# EAGLE design kiosk_power_revB (EAGLE 9.0.0)
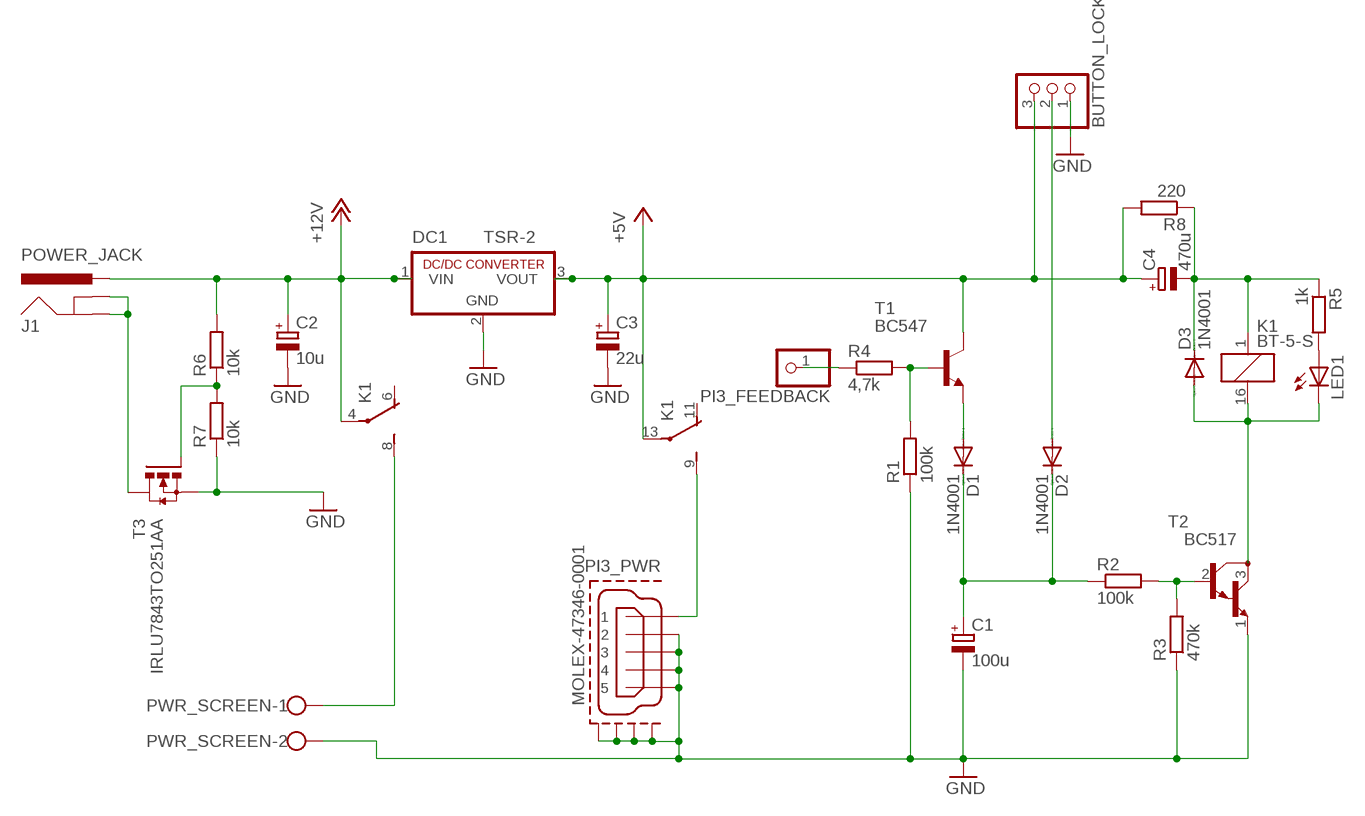
[diagram p0: schematic, sheet 1]

## Parts
BUTTON_LOCK  PINHD-1X3/90  [1X03/90]
C1  100u  CPOL-EUE2.5-5  [E2,5-5]
C2  10u  CPOL-EUE2.5-6  [E2,5-6]
C3  22u  CPOL-EUE2.5-5  [E2,5-5]
C4  470u  CPOL-EUE2-5  [E2-5]
D1  1N4001  [DO41-10]
D2  1N4001  [DO41-10]
D3  1N4001  [DO41-10]
DC1  TSR-2  [SIP3]
J1  POWER_JACK  [POWER_JACK_PTH]
K1  BT-5-S  [BT-XX-S]
LED1  LED3MM  [LED3MM]
PI3_FEEDBACK  PINHD-1X1/90  [1X01/90]
PI3_PWR  MOLEX-47346-0001  [MOLEX-47364-0001]
PWR_SCREEN  W237-102  [W237-102]
R1  100k  R-EU_0207/7  [0207/7]
R2  100k  R-EU_0207/7  [0207/7]
R3  470k  R-EU_0207/7  [0207/7]
R4  4,7k  R-EU_0207/7  [0207/7]
R5  1k  R-EU_0207/7  [0207/7]
R6  10k  R-EU_0207/7  [0207/7]
R7  10k  R-EU_0207/7  [0207/7]
R8  220  R-EU_0207/7  [0207/7]
T1  BC547  [TO92]
T2  BC517  [TO92]
T3  IRLU7843TO251AA  [TO251AA-V]

## Nets
+5V: BUTTON_LOCK.3 C3.+ C4.+ DC1.3(VOUT) K1.13(-2:P) R8.2 T1.3(C)
+12V: C2.+ DC1.1(VIN) J1.PWR K1.4(-1:P) R6.2
GND: BUTTON_LOCK.1 C1.- C2.- C3.- DC1.2(GND) PI3_PWR.2 PI3_PWR.3 PI3_PWR.4 PI3_PWR.5 PI3_PWR.GND1 PI3_PWR.GND2 PI3_PWR.GND3 PI3_PWR.GND4 PWR_SCREEN.2 R1.1 R3.1 R7.1 T2.1(E) T3.3(S)
N$1: J1.GND J1.GNDBREAK T3.2(D)
N$2: K1.8(-1:S) PWR_SCREEN.1
N$3: C4.- D3.C K1.1 R5.1 R8.1
N$4: PI3_FEEDBACK.1 R4.1
N$5: K1.9(-2:S) PI3_PWR.1
N$6: D3.A K1.16 LED1.K(C) T2.3(C)
N$7: BUTTON_LOCK.2 D2.A
N$8: R6.1 R7.2 T3.1(G)
N$9: R1.2 R4.2 T1.2(B)
N$10: D1.A T1.1(E)
N$11: C1.+ D1.C D2.C R2.1
N$12: LED1.A R5.2
N$13: R2.2 R3.2 T2.2(B)
Unconnected: K1.6(-1:O) K1.11(-2:O)

## Library data of the parts
BUTTON_LOCK = pinhead:PINHD-1X3: PIN HEADER
C1-C4 = resistor:CPOL-EU: POLARIZED CAPACITOR, European symbol
D1-D3 = kiosk:1N4001: DIODE general purpose rectifier, 1 A
DC1 = kiosk:TSR-2: TSR 2 Description: The new TSR 2 series step-down switching regulators are drop-in replacement for inefficient LMxx linear regulators. A high efficiency up to 96 % allows full load operation up to +67°C ambient temperature without the need of any heat-sink or forced cooling. The TSR 2 switching regulators provide other significant features over linear regulators, i.e. better output accuracy (±2 %), lower standby current of 2 mA and no requirement of external capacitors. The high efficiency and low standby power consumption makes these regulators an ideal solution for many battery powered applications. Datasheet: TSR 2 <http://assets.tracopower.com/20180412091955/TSR2/documents/tsr2-datasheet.pdf>; MF: Traco; OC_NEWARK: 85Y2519
J1 = kiosk:POWER_JACK: Power Jack Connector This is the standard 5.5mm barrel jack for power. The PTH is the most common, proven, reliable, footprint. The Slot footprint only works if the mill layer is transmitted to the PCB fab house so be warned. Here are the connectors we sell at SparkFun: DC Barrel Power Jack/Connector <https://www.sparkfun.com/products/119> (PRT-00119) DC Barrel Power Jack/Connector (SMD) <https://www.sparkfun.com/products/12748> (PRT-12748) DC Barrel Jack Adapter - Breadboard Compatible <https://www.sparkfun.com/products/10811> (PRT-10811) It is used on this SparkFun product (and many, many others): SparkFun RedBoard - Programmed with Arduino <https://www.sparkfun.com/products/12757> (DEV-12757) Also, if you need a mating power supply or connector, please check these out: Wall Adapter Power Supply - 9VDC 650mA <https://www.sparkfun.com/products/298> (TOL-00298) DC Barrel Jack Adapter - Male <https://www.sparkfun.com/products/10287> (PRT-10287); PROD_ID: CONN-08197
K1 = relay:BT-*-S: KLEIN RELAIS WASCHDICHT 2 Wechsler Distriibutor: Conrad Electronic, Bestell Nr.: 505226-13 - 24V 505226-13 - 5V 505170-13 - 12V 505170-13 - 48V Bestar Electric Ltd. Source: http://www2.produktinfo.conrad.com/datenblaetter/500000-524999/505226-da-01-en-Kleinrelais_waschdicht_24V.pdf; OC_FARNELL: unknown; OC_NEWARK: unknown
LED1 = led:LED: LED OSRAM: - CHIPLED LG R971, LG N971, LY N971, LG Q971, LY Q971, LO R971, LY R971 LH N974, LH R974 LS Q976, LO Q976, LY Q976 LO Q996 - Hyper CHIPLED LW Q18S LB Q993, LB Q99A, LB R99A - SideLED LS A670, LO A670, LY A670, LG A670, LP A670 LB A673, LV A673, LT A673, LW A673 LH A674 LY A675 LS A676, LA A676, LO A676, LY A676, LW A676 LS A679, LY A679, LG A679 - Hyper Micro SIDELED® LS Y876, LA Y876, LO Y876, LY Y876 LT Y87S - SmartLED LW L88C, LW L88S LB L89C, LB L89S, LG L890 LS L89K, LO L89K, LY L89K LS L896, LA L896, LO L896, LY L896 - TOPLED LS T670, LO T670, LY T670, LG T670, LP T670 LSG T670, LSP T670, LSY T670, LOP T670, LYG T670 LG T671, LOG T671, LSG T671 LB T673, LV T673, LT T673, LW T673 LH T674 LS T676, LA T676, LO T676, LY T676, LB T676, LH T676, LSB T676, LW T676 LB T67C, LV T67C, LT T67C, LS T67K, LO T67K, LY T67K, LW E67C LS E67B, LA E67B, LO E67B, LY E67B, LB E67C, LV E67C, LT E67C LW T67C LS T679, LY T679, LG T679 LS T770, LO T770, LY T770, LG T770, LP T770 LB T773, LV T773, LT T773, LW T773 LH T774 LS E675, LA E675, LY E675, LS T675 LS T776, LA T776, LO T776, LY T776, LB T776 LHGB T686 LT T68C, LB T68C - Hyper Mini TOPLED® LB M676 - Mini TOPLED Santana® LG M470 LS M47K, LO M47K, LY M47K Source: http://www.osram.convergy.de LUXEON: - LUMILED® LXK2-PW12-R00, LXK2-PW12-S00, LXK2-PW14-U00, LXK2-PW14-V00 LXK2-PM12-R00, LXK2-PM12-S00, LXK2-PM14-U00 LXK2-PE12-Q00, LXK2-PE12-R00, LXK2-PE12-S00, LXK2-PE14-T00, LXK2-PE14-U00 LXK2-PB12-K00, LXK2-PB12-L00, LXK2-PB12-M00, LXK2-PB14-N00, LXK2-PB14-P00, LXK2-PB14-Q00 LXK2-PR12-L00, LXK2-PR12-M00, LXK2-PR14-Q00, LXK2-PR14-R00 LXK2-PD12-Q00, LXK2-PD12-R00, LXK2-PD12-S00 LXK2-PH12-R00, LXK2-PH12-S00 LXK2-PL12-P00, LXK2-PL12-Q00, LXK2-PL12-R00 Source: www.luxeon.com KINGBRIGHT: KA-3528ASYC Source: www.kingbright.com
PI3_FEEDBACK = kiosk:PINHD-1X1: PIN HEADER
PI3_PWR = kiosk:MOLEX-47346-0001: MICRO USB B, BOTTOM MOUNT
PWR_SCREEN = con-wago-500:W237-102: WAGO SCREW CLAMP; MPN: 237-102; OC_FARNELL: unknown; OC_NEWARK: 70K9898
R1-R8 = resistor:R-EU_: RESISTOR, European symbol
T1 = transistor:BC547: NPN TRANSISTOR
T2 = transistor:BC517: NPN BIPOLAR DARLINGTON TRANSISTOR
T3 = kiosk:IRLU7843: Power MOSFET; MF: International Rectifier

## Board
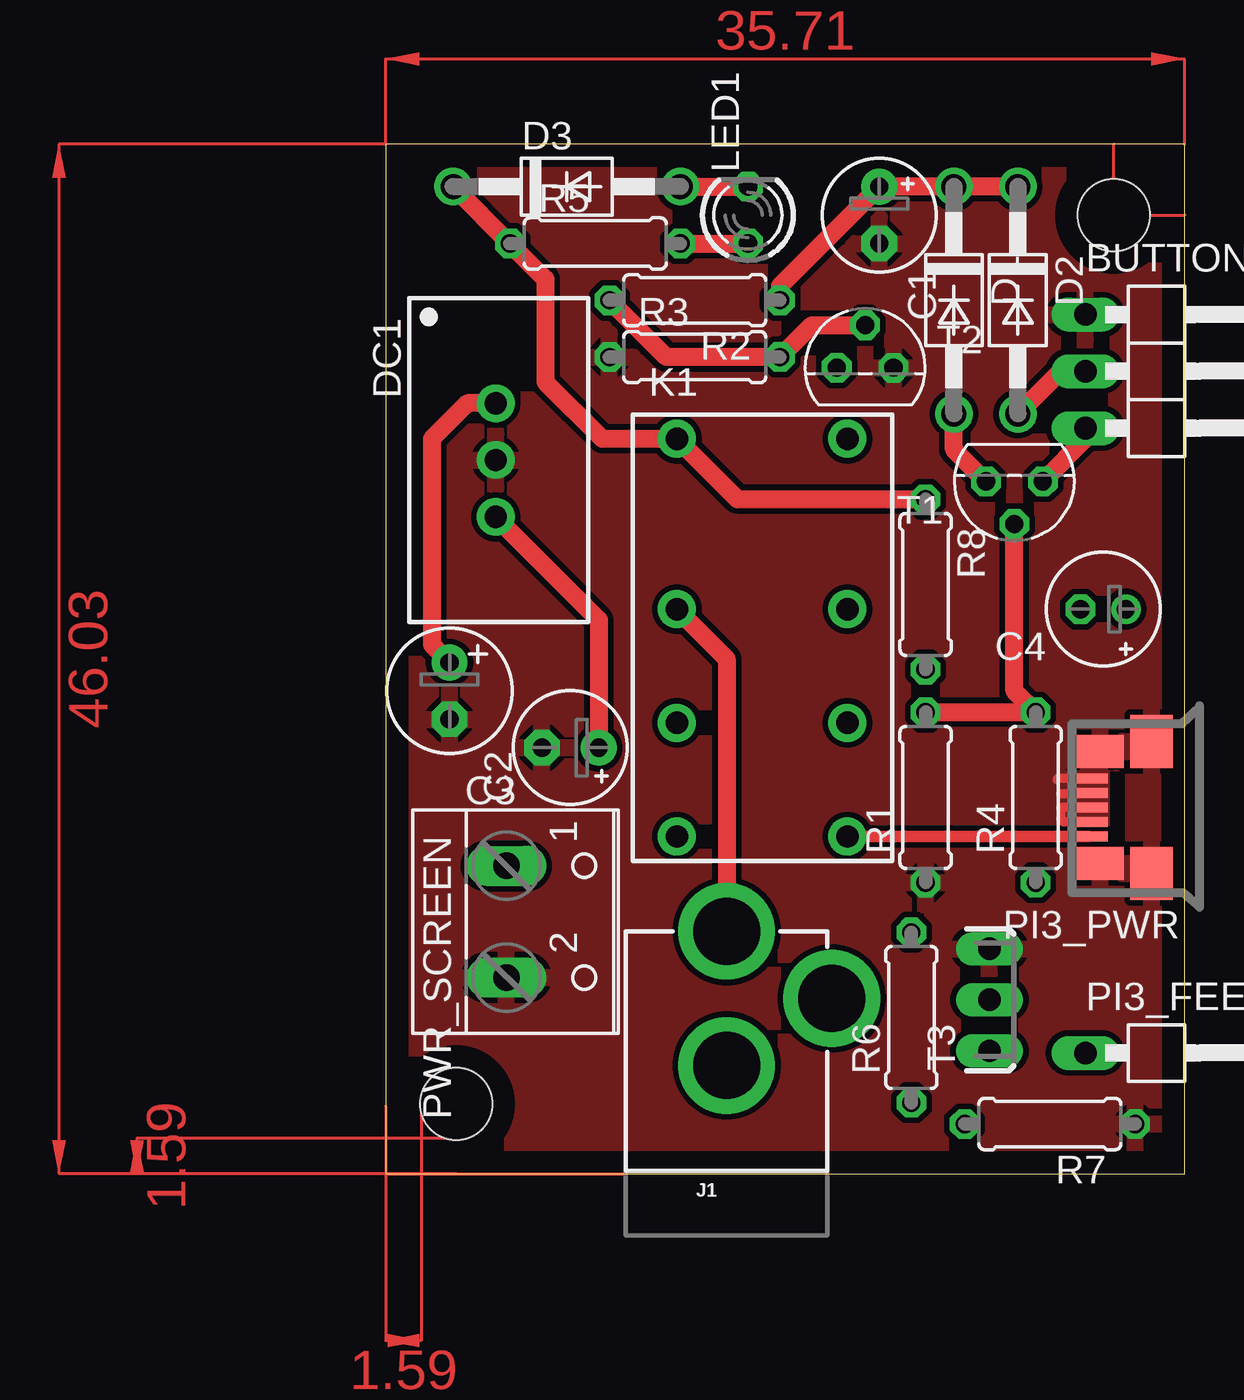
[diagram p1: board, top side]
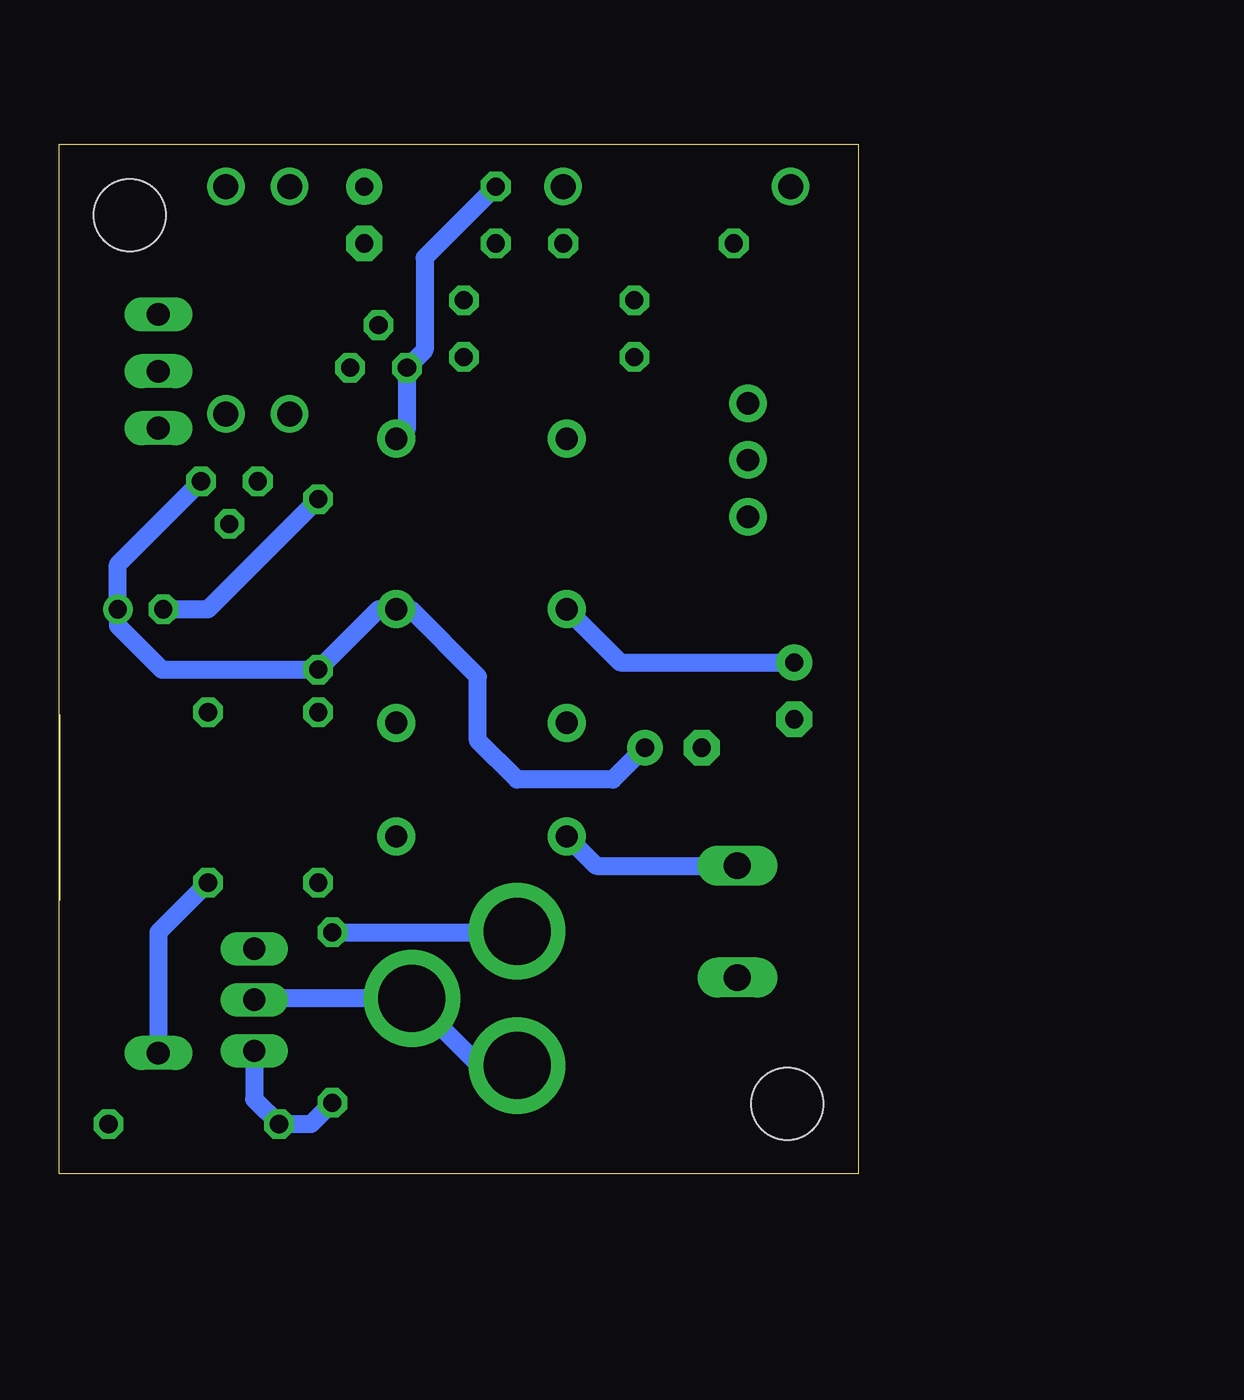
[diagram p2: board, bottom side, seen from below]

Size 35.71 x 46.03 mm. Coordinates in mm from the lower left corner, seen from the top.
Outline: 0,0 35.71,0 35.71,46.03 0,46.03 0,0
Copper layers (1*16): Top 0.035mm / dielectric 1.5mm / Bottom 0.035mm
Design rules "default *": minimum track width 6mil, minimum drill 0.35mm, track to track 10mil, track to pad 10mil, pad to pad 6mil, via to via 6mil, smd to smd 6mil, copper to edge 40mil, drill to drill 6mil, minimum pad ring 10mil, minimum via ring 8mil, stop-mask expansion 4mil, vias tented up to drill 0mil, thermal gap 10mil
Holes 3.2 mm at 3.16,3.13 32.54,42.86

### Footprints (pad centres in the part's own frame; a part is rotated, then mirrored left to right if it is on the bottom)
1X03/90 = drill 1.016 long: 1 -2.54,-3.81; 2 0,-3.81; 3 2.54,-3.81
E2,5-5 = drill 0.813 pad 1.6: + -1.27,0 | drill 0.813 pad 1.6 octagon: - 1.27,0
E2,5-6 = drill 0.813 pad 1.6: + -1.27,0 | drill 0.813 pad 1.6 octagon: - 1.27,0
E2-5 = drill 0.813 pad 1.27: + -1.016,0 | drill 0.813 pad 1.27 octagon: - 1.016,0
DO41-10 = drill 1.118: A 5.08,0; C -5.08,0
SIP3 = drill 1 pad 1.676: 1 -2.54,0; 2 0,0; 3 2.54,0
POWER_JACK_PTH = drill 2.997 pad 4.318: GND 0,7.7; GNDBREAK 4.7,10.7; PWR 0,13.7
BT-XX-S = drill 1 pad 1.7: 1 -8.89,-3.81; 4 -1.27,-3.81; 6 3.81,-3.81; 8 8.89,-3.81; 9 8.89,3.81; 11 3.81,3.81; 13 -1.27,3.81; 16 -8.89,3.81
LED3MM = drill 0.813 octagon: A -1.27,0; K 1.27,0
1X01/90 = drill 1.016 long: 1 -1.27,-3.81
MOLEX-47364-0001 = smd 1.7 x 0.45: 1 2.8,1.3; 2 2.8,0.65; 3 2.8,0; 4 2.8,-0.65; 5 2.8,-1.3 | smd 1.9 x 2.375: GND1 0,2.95; GND4 0,-2.95 | smd 2.1 x 1.475: GND2 2.3,2.5; GND3 2.3,-2.5
W237-102 = drill 1.194 long: 1 -2.5,-1.27; 2 2.5,-1.27
0207/7 = drill 0.813 octagon: 1 -3.81,0; 2 3.81,0
TO92 = drill 0.813 octagon: 1 1.27,0; 2 0,1.905; 3 -1.27,0
TO251AA-V = drill 1 long: 1 -2.286,0; 2 0,0; 3 2.286,0

### Placement (x,y rotation side)
BUTTON_LOCK  35.08,35.88 270 top
C1  22.07,42.86 270 top
C2  2.86,21.59 270 top
C3  8.25,19.05 180 top
C4  32.07,25.24 180 top
D1  25.4,39.05 270 top
D2  28.26,39.05 270 top
D3  8.1,44.13 0 top
DC1  4.92,31.91 270 top
J1  15.24,-2.86 0 top
K1  16.83,23.97 270 top
LED1  16.19,42.86 90 top
PI3_FEEDBACK  35.08,4.13 270 top
PI3_PWR  34.23,16.38 180 top
PWR_SCREEN  6.67,11.27 270 top
R1  24.13,16.83 90 top
R2  13.81,39.05 180 top
R3  13.81,36.51 0 top
R4  29.05,16.83 90 top
R5  9.37,41.59 0 top
R6  23.49,6.98 90 top
R7  29.69,2.22 180 top
R8  24.13,26.35 270 top
T1  28.1,30.96 180 top
T2  21.43,36.04 0 top
T3  26.99,7.78 90 top

### Tracks (layer width: path | path; a pad name or v marks a point on that pad's centre or on a via)
+5V
  Top 0.813: BUTTON_LOCK.3 31.27,32.86 T1.3 | DC1.3 9.52,24.76 C3.+
  Bottom 0.813: T1.3 33.08,27.24 C4.+ 33.08,24.51 31.11,22.54 R8.2 21.43,25.24 K1.13 20,25.24 16.99,22.22 16.99,19.37 15.24,17.62 10.95,17.62 C3.+
+12V
  Top 0.813: DC1.1 3.65,34.45 2.06,32.86 2.06,23.65 C2.+ | K1.4 15.24,23.02 J1.PWR
  Bottom 0.813: K1.4 10.64,22.86 C2.+ | R6.2 15.29,10.79 J1.PWR
GND
  Top 0.406: PI3_PWR.5 30.06,17.68 30,17.62 | PI3_PWR.4 31.39,16.99 30.16,16.99 | PI3_PWR.3 30.19,16.38 | 30.19,16.38 30.16,16.35 | PI3_PWR.2 30.31,15.73 30.16,15.87 30.19,15.9 30.19,16.38
  pour Top: -1.27,46.67 36.67,46.83 37.15,-0.95 -1.11,-1.11
N$1
  Bottom 0.813: J1.GND 16.94,4.84 J1.GNDBREAK 26.92,7.84 T3.2
N$2
  Bottom 0.813: K1.8 11.71,13.77 PWR_SCREEN.1
N$3
  Top 0.813: D3.C R5.1 7.14,40 7.14,35.4 9.68,32.86 K1.1 15.72,30.16 R8.1
  Bottom 0.813: C4.- 29.05,25.24 R8.1
N$4
  Bottom 0.813: R4.1 31.27,10.79 PI3_FEEDBACK.1
N$5
  Top 0.508: K1.9 PI3_PWR.1
N$6
  Top 0.813: D3.A LED1.K
  Bottom 0.813: LED1.K 19.37,40.96 19.37,36.83 T2.3 20.16,33.34 K1.16
N$7
  Top 0.813: D2.A 30.16,35.88 BUTTON_LOCK.2
N$8
  Bottom 0.813: T3.1 26.99,3.33 R7.2 24.45,2.22 R6.1
N$9
  Top 0.813: R1.2 R4.2 28.1,21.59 T1.2
N$10
  Top 0.813: T1.1 25.4,32.38 D1.A
N$11
  Top 0.813: D2.C D1.C C1.+ 17.62,39.69 R2.1
N$12
  Top 0.813: R5.2 LED1.A
N$13
  Top 0.813: R2.2 12.54,36.51 R3.2 19.05,37.94 T2.2
(copper drawn outside any net)
  shapes: Top area x8